# Altium schematic sheet Raspberry Pi and RF Devices.SchDoc
size B; SheetNumber: 1; SheetTotal: 5
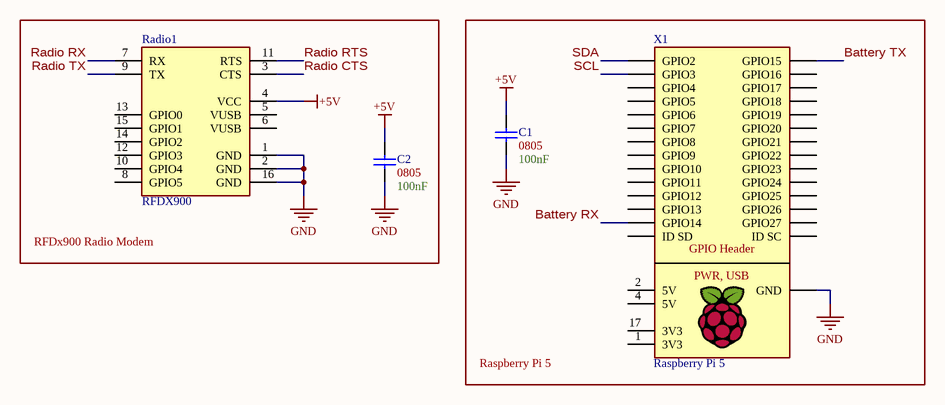
[diagram p0: Raspberry Pi and RF Devices.SchDoc]

## Parts
C1  Size Package: 0805  Capacitance: 100nF  [[Cap] SMD 0805]  (hidden comment: SMD Nonpolarized)
C2  Size Package: 0805  Capacitance: 100nF  [[Cap] SMD 0805]  (hidden comment: SMD Nonpolarized)
Radio1  RFDX900  [[Device] RFDX900 Radio]
X1  Raspberry Pi 5  [[Device] Raspberry Pi 5]

## Blocks framed on the sheet
RFDx900 Radio Modem: C2 Radio1
Raspberry Pi 5: C1 X1

## Nets
+5V: C1.1 C2.1 Radio1.4(VCC)
GND: C1.2 C2.2 Radio1.1(GND) Radio1.2(GND) Radio1.16(GND) X1.GND
Battery RX: X1.8(GPIO14)
Battery TX: X1.10(GPIO15)
Radio CTS: Radio1.3(CTS)
Radio RTS: Radio1.11(RTS)
Radio RX: Radio1.7(RX)
Radio TX: Radio1.9(TX)
SCL: X1.5(GPIO3)
SDA: X1.3(GPIO2)

Not connected (* = marked no-connect by the designer): Radio1 5(VUSB) 6(VUSB) 8(GPIO5) 10(GPIO4) 12(GPIO3) 13(GPIO0) 14(GPIO2) 15(GPIO1); X1 1(3V3) 2(5V) 4(5V) 7(GPIO4) 11(GPIO17) 12(GPIO18) 13(GPIO27) 15(GPIO22) 16(GPIO23) 17(3V3) 18(GPIO24) 19(GPIO10) 21(GPIO9) 22(GPIO25) 23(GPIO11) 24(GPIO7) 26(GPIO8) 27(ID_SD) 28(ID_SC) 29(GPIO5) 31(GPIO6) 32(GPIO12) 33(GPIO13) 35(GPIO19) 36(GPIO16) 37(GPIO26) 38(GPIO20) 40(GPIO21)

## Notes on the sheet
- (in symbol [Device] Raspberry Pi 5) GPIO Header; PWR, USB

## Library data of the parts
C1 C2 = [Cap] SMD Nonpolarized
Radio1 = [Device] RFDX900 Radio: RFDX900 Long-Range RF Module
X1 = [Device] Raspberry Pi 5